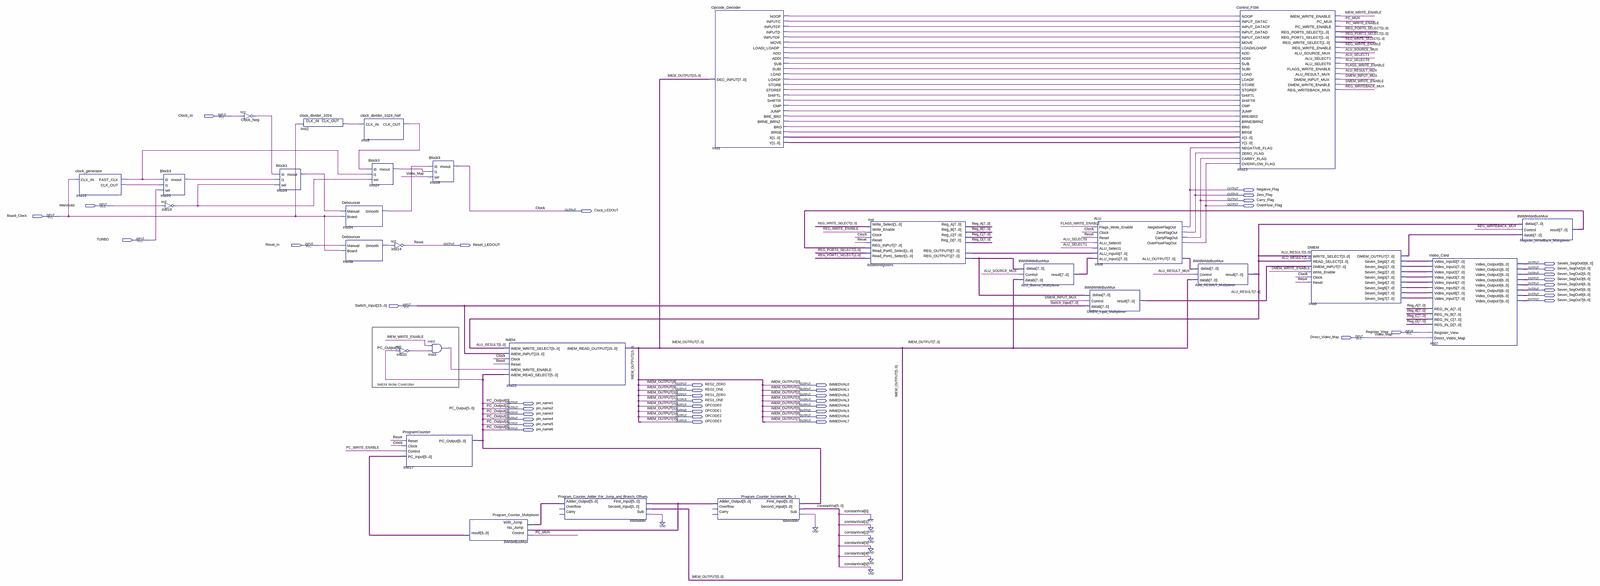
[diagram p0: schematic sheet, whole]
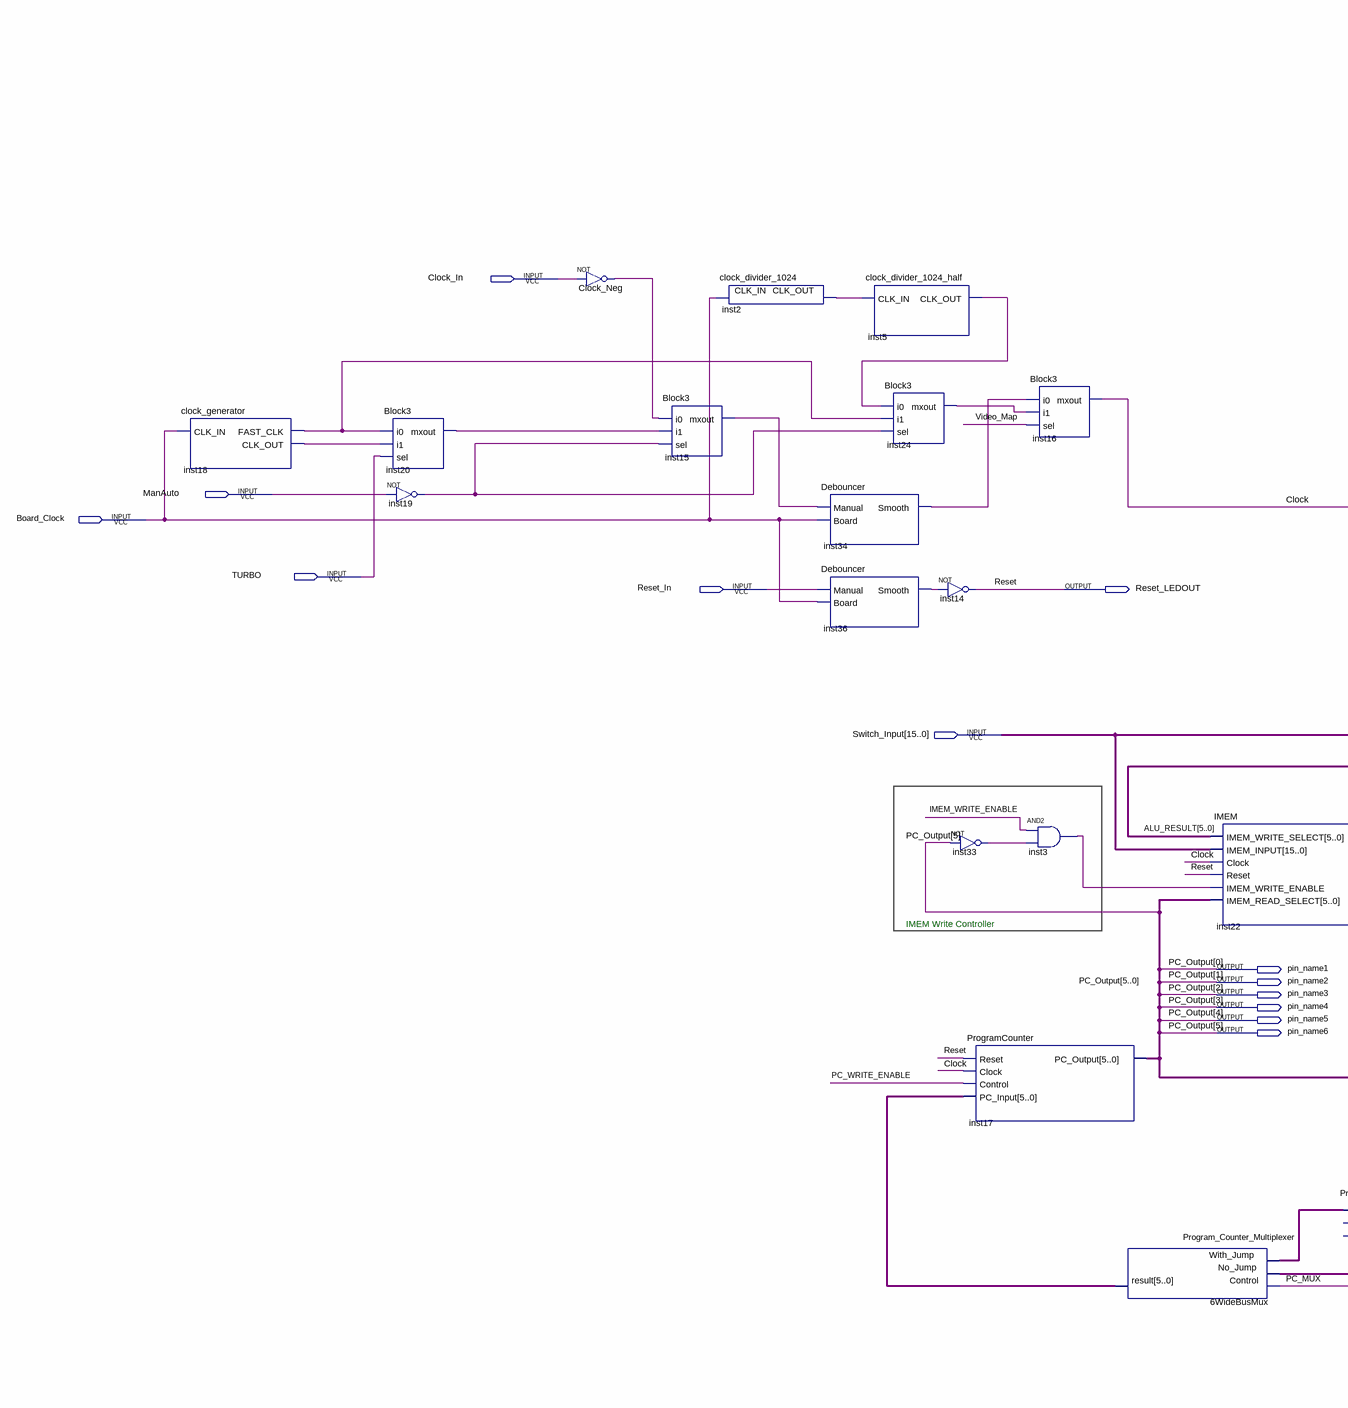
[diagram p1: schematic sheet, left part]
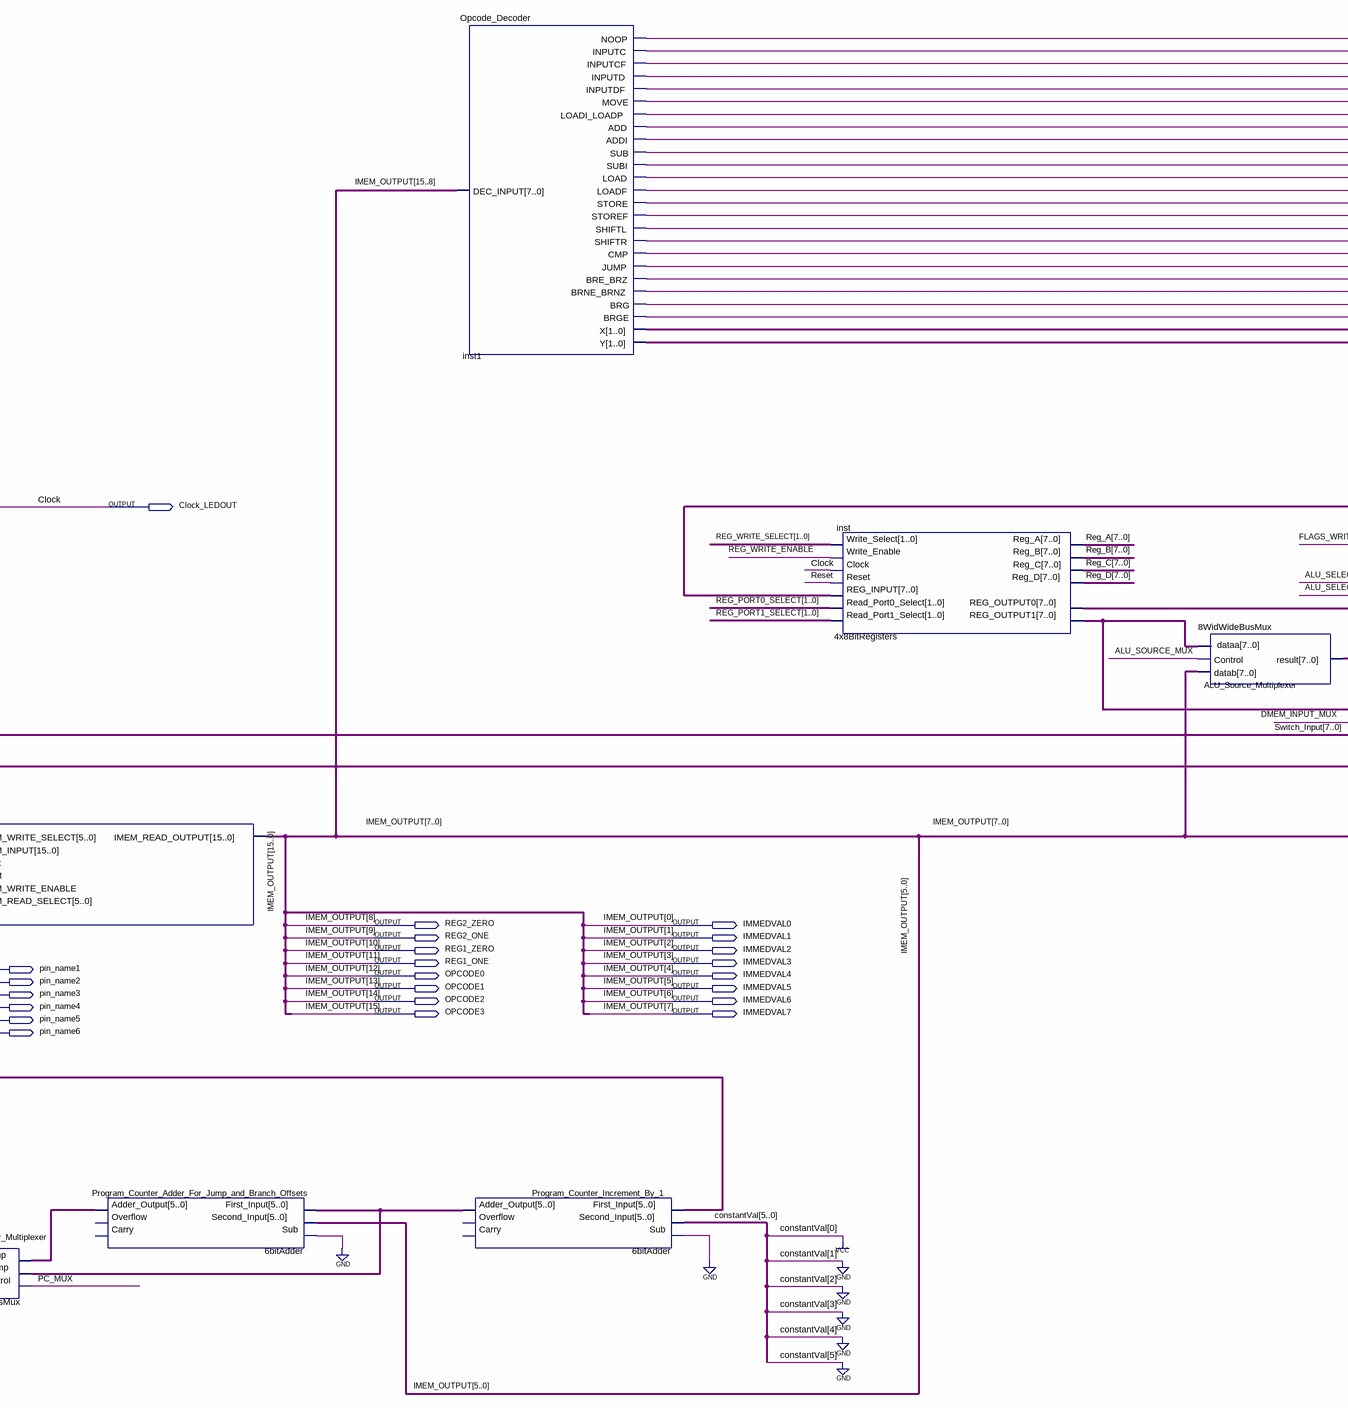
[diagram p2: schematic sheet, centre part]
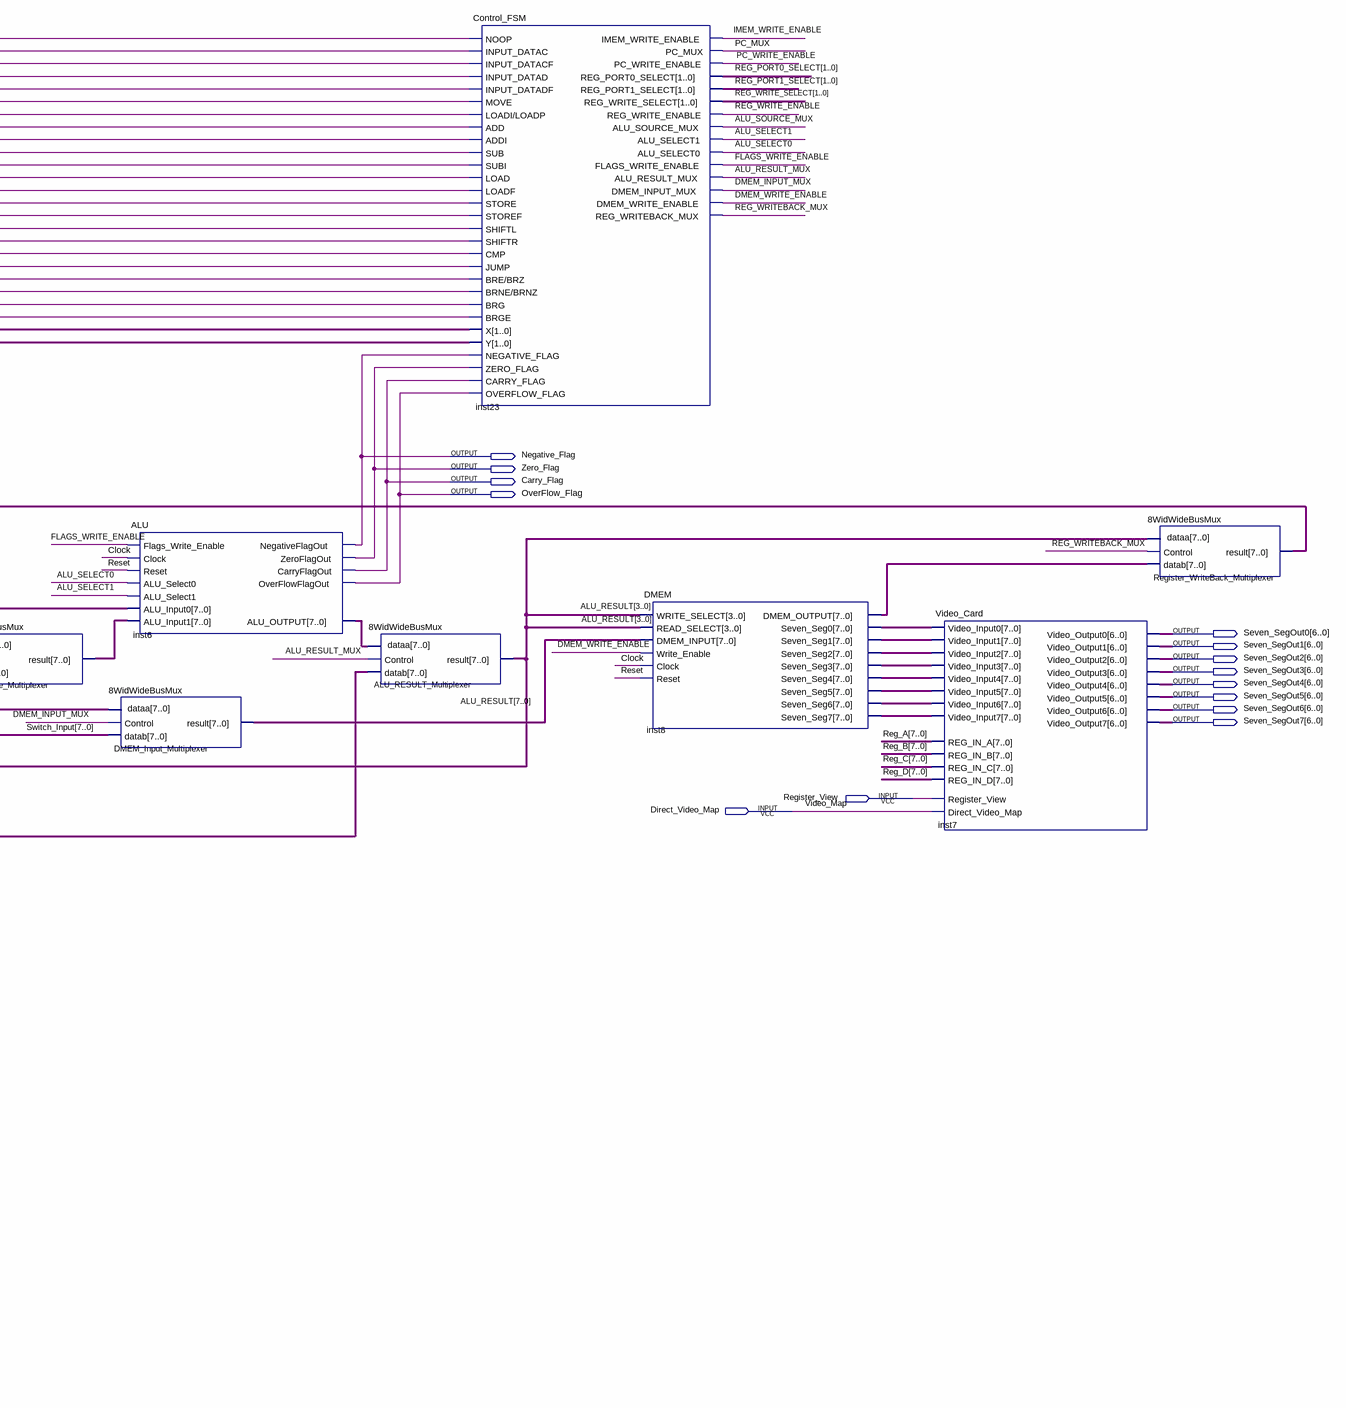
[diagram p3: schematic sheet, right part]
// Quartus schematic i281_CPU.bdf as structural Verilog: 29 symbols, 44 pins
module i281_CPU (
  input  Clock_In,
  input  ManAuto,
  input  Board_Clock,
  input  TURBO,
  input  Reset_In,
  input  [15:0] Switch_Input,
  input  Register_View,
  input  Direct_Video_Map,
  output Negative_Flag,
  output Zero_Flag,
  output Carry_Flag,
  output OverFlow_Flag,
  output Clock_LEDOUT,
  output Reset_LEDOUT,
  output [6:0] Seven_SegOut0,
  output [6:0] Seven_SegOut1,
  output [6:0] Seven_SegOut2,
  output [6:0] Seven_SegOut3,
  output [6:0] Seven_SegOut4,
  output [6:0] Seven_SegOut5,
  output [6:0] Seven_SegOut6,
  output [6:0] Seven_SegOut7,
  output REG2_ZERO,
  output IMMEDVAL0,
  output REG2_ONE,
  output IMMEDVAL1,
  output REG1_ZERO,
  output IMMEDVAL2,
  output REG1_ONE,
  output IMMEDVAL3,
  output pin_name1,
  output OPCODE0,
  output IMMEDVAL4,
  output pin_name2,
  output OPCODE1,
  output IMMEDVAL5,
  output pin_name3,
  output OPCODE2,
  output IMMEDVAL6,
  output pin_name4,
  output OPCODE3,
  output IMMEDVAL7,
  output pin_name5,
  output pin_name6
);

  wire ALU_RESULT_MUX, ALU_SELECT0, ALU_SELECT1, ALU_SOURCE_MUX, Clock_Neg_out, DMEM_INPUT_MUX,
       DMEM_WRITE_ENABLE, FLAGS_WRITE_ENABLE, IMEM_WRITE_ENABLE, inst1_add, inst1_addi, inst1_bre_brz,
       inst1_brg, inst1_brge, inst1_brne_brnz, inst1_cmp, inst1_inputc, inst1_inputcf, inst1_inputd,
       inst1_inputdf, inst1_jump, inst1_load, inst1_loadf, inst1_loadi_loadp, inst1_move, inst1_noop,
       inst1_shiftl, inst1_shiftr, inst1_store, inst1_storef, inst1_sub, inst1_subi, inst2_clk_out,
       inst3_out, inst5_clk_out, inst15_mxout, inst18_clk_out, inst18_fast_clk, inst19_out, inst20_mxout,
       inst24_mxout, inst33_out, inst34_smooth, inst36_smooth, PC_MUX, PC_WRITE_ENABLE, REG_WRITE_ENABLE,
       REG_WRITEBACK_MUX;
  wire [1:0] inst1_x, inst1_y, REG_PORT0_SELECT, REG_PORT1_SELECT, REG_WRITE_SELECT;
  wire [5:0] Program_Counter_Adder_For_Jump_and_Branch_Offsets_adder_output,
       Program_Counter_Increment_By_1_adder_output, Program_Counter_Multiplexer_result;
  wire [7:0] ALU_RESULT, ALU_Source_Multiplexer_result, DMEM_Input_Multiplexer_result, inst6_alu_output,
       inst8_dmem_output, inst8_seven_seg0, inst8_seven_seg1, inst8_seven_seg2, inst8_seven_seg3,
       inst8_seven_seg4, inst8_seven_seg5, inst8_seven_seg6, inst8_seven_seg7, inst_reg_output0,
       inst_reg_output1, Reg_A, Reg_B, Reg_C, Reg_D, Register_WriteBack_Multiplexer_result;

  clock_generator inst18 (.CLK_IN(Board_Clock), .FAST_CLK(inst18_fast_clk), .CLK_OUT(inst18_clk_out));
  Block3 inst20 (.i0(inst18_fast_clk), .i1(inst18_clk_out), .sel(TURBO), .mxout(inst20_mxout));
  not inst19 (inst19_out, ManAuto);
  not Clock_Neg (Clock_Neg_out, Clock_In);
  Block3 inst15 (.i0(Clock_Neg_out), .i1(inst20_mxout), .sel(inst19_out), .mxout(inst15_mxout));
  clock_divider_1024 inst2 (.CLK_IN(Board_Clock), .CLK_OUT(inst2_clk_out));
  Debouncer inst34 (.Manual(inst15_mxout), .Board(Board_Clock), .Smooth(inst34_smooth));
  Debouncer inst36 (.Manual(Reset_In), .Board(Board_Clock), .Smooth(inst36_smooth));
  clock_divider_1024_half inst5 (.CLK_IN(inst2_clk_out), .CLK_OUT(inst5_clk_out));
  Block3 inst24 (.i0(inst5_clk_out), .i1(inst18_fast_clk), .sel(inst19_out), .mxout(inst24_mxout));
  not inst14 (Reset_LEDOUT, inst36_smooth);
  not inst33 (inst33_out, pin_name6);
  ProgramCounter inst17 (
    .Reset(Reset_LEDOUT), .Clock(Clock_LEDOUT), .Control(PC_WRITE_ENABLE),
    .PC_Input(Program_Counter_Multiplexer_result),
    .PC_Output({pin_name6, pin_name5, pin_name4, pin_name3, pin_name2, pin_name1}));
  Block3 inst16 (.i0(inst34_smooth), .i1(inst24_mxout), .sel(Direct_Video_Map), .mxout(Clock_LEDOUT));
  and inst3 (inst3_out, IMEM_WRITE_ENABLE, inst33_out);
  \6WideBusMux  Program_Counter_Multiplexer (
    .Control(PC_MUX), .dataBline(Program_Counter_Adder_For_Jump_and_Branch_Offsets_adder_output),
    .dataAline(Program_Counter_Increment_By_1_adder_output), .result(Program_Counter_Multiplexer_result));
  IMEM inst22 (
    .Clock(Clock_LEDOUT), .Reset(Reset_LEDOUT),
    .IMEM_READ_SELECT({pin_name6, pin_name5, pin_name4, pin_name3, pin_name2, pin_name1}),
    .IMEM_WRITE_SELECT(ALU_RESULT[5:0]), .IMEM_INPUT(Switch_Input), .IMEM_WRITE_ENABLE(inst3_out),
    .IMEM_READ_OUTPUT({OPCODE3, OPCODE2, OPCODE1, OPCODE0, REG1_ONE, REG1_ZERO, REG2_ONE, REG2_ZERO, IMMEDVAL7, IMMEDVAL6, IMMEDVAL5, IMMEDVAL4, IMMEDVAL3, IMMEDVAL2, IMMEDVAL1, IMMEDVAL0}));
  \6bitAdder  Program_Counter_Adder_For_Jump_and_Branch_Offsets (
    .Sub(1'b0), .Second_Input({IMMEDVAL5, IMMEDVAL4, IMMEDVAL3, IMMEDVAL2, IMMEDVAL1, IMMEDVAL0}),
    .First_Input(Program_Counter_Increment_By_1_adder_output),
    .Adder_Output(Program_Counter_Adder_For_Jump_and_Branch_Offsets_adder_output));  // open: Carry, Overflow
  Opcode_Decoder inst1 (
    .DEC_INPUT({OPCODE3, OPCODE2, OPCODE1, OPCODE0, REG1_ONE, REG1_ZERO, REG2_ONE, REG2_ZERO}),
    .NOOP(inst1_noop), .INPUTC(inst1_inputc), .INPUTCF(inst1_inputcf), .INPUTD(inst1_inputd),
    .INPUTDF(inst1_inputdf), .MOVE(inst1_move), .LOADI_LOADP(inst1_loadi_loadp), .ADD(inst1_add),
    .ADDI(inst1_addi), .SUB(inst1_sub), .SUBI(inst1_subi), .LOAD(inst1_load), .LOADF(inst1_loadf),
    .STORE(inst1_store), .STOREF(inst1_storef), .SHIFTL(inst1_shiftl), .SHIFTR(inst1_shiftr),
    .CMP(inst1_cmp), .JUMP(inst1_jump), .BRE_BRZ(inst1_bre_brz), .BRNE_BRNZ(inst1_brne_brnz),
    .BRG(inst1_brg), .BRGE(inst1_brge), .X(inst1_x), .Y(inst1_y));
  \6bitAdder  Program_Counter_Increment_By_1 (
    .Sub(1'b0), .Second_Input(6'b000001),
    .First_Input({pin_name6, pin_name5, pin_name4, pin_name3, pin_name2, pin_name1}),
    .Adder_Output(Program_Counter_Increment_By_1_adder_output));  // open: Carry, Overflow
  \4x8BitRegisters  inst (
    .Read_Port1_Select(REG_PORT1_SELECT), .Read_Port0_Select(REG_PORT0_SELECT),
    .REG_INPUT(Register_WriteBack_Multiplexer_result), .Reset(Reset_LEDOUT), .Clock(Clock_LEDOUT),
    .Write_Enable(REG_WRITE_ENABLE), .Write_Select(REG_WRITE_SELECT), .Reg_A(Reg_A), .Reg_B(Reg_B),
    .REG_OUTPUT1(inst_reg_output1), .REG_OUTPUT0(inst_reg_output0), .Reg_C(Reg_C), .Reg_D(Reg_D));
  \8WidWideBusMux  ALU_Source_Multiplexer (
    .Control(ALU_SOURCE_MUX), .dataa(inst_reg_output1),
    .datab({IMMEDVAL7, IMMEDVAL6, IMMEDVAL5, IMMEDVAL4, IMMEDVAL3, IMMEDVAL2, IMMEDVAL1, IMMEDVAL0}),
    .result(ALU_Source_Multiplexer_result));
  \8WidWideBusMux  DMEM_Input_Multiplexer (
    .Control(DMEM_INPUT_MUX), .dataa(inst_reg_output1), .datab(Switch_Input[7:0]),
    .result(DMEM_Input_Multiplexer_result));
  ALU inst6 (
    .ALU_Select0(ALU_SELECT0), .ALU_Input0(inst_reg_output0), .ALU_Select1(ALU_SELECT1),
    .ALU_Input1(ALU_Source_Multiplexer_result), .Clock(Clock_LEDOUT), .Reset(Reset_LEDOUT),
    .Flags_Write_Enable(FLAGS_WRITE_ENABLE), .ALU_OUTPUT(inst6_alu_output), .NegativeFlagOut(Negative_Flag),
    .ZeroFlagOut(Zero_Flag), .CarryFlagOut(Carry_Flag), .OverFlowFlagOut(OverFlow_Flag));
  \8WidWideBusMux  ALU_RESULT_Multiplexer (
    .Control(ALU_RESULT_MUX), .dataa(inst6_alu_output),
    .datab({IMMEDVAL7, IMMEDVAL6, IMMEDVAL5, IMMEDVAL4, IMMEDVAL3, IMMEDVAL2, IMMEDVAL1, IMMEDVAL0}),
    .result(ALU_RESULT));
  Control_FSM inst23 (
    .OVERFLOW_FLAG(OverFlow_Flag), .INPUT_DATACF(inst1_inputcf), .INPUT_DATADF(inst1_inputdf),
    .NEGATIVE_FLAG(Negative_Flag), .NOOP(inst1_noop), .INPUT_DATAC(inst1_inputc), .INPUT_DATAD(inst1_inputd),
    .MOVE(inst1_move), .ADD(inst1_add), .ADDI(inst1_addi), .SUB(inst1_sub), .SUBI(inst1_subi),
    .LOAD(inst1_load), .LOADF(inst1_loadf), .STORE(inst1_store), .STOREF(inst1_storef),
    .SHIFTL(inst1_shiftl), .SHIFTR(inst1_shiftr), .CMP(inst1_cmp), .ZERO_FLAG(Zero_Flag), .JUMP(inst1_jump),
    .\BRE/BRZ (inst1_bre_brz), .\BRNE/BRNZ (inst1_brne_brnz), .BRG(inst1_brg), .CARRY_FLAG(Carry_Flag),
    .BRGE(inst1_brge), .\LOADI/LOADP (inst1_loadi_loadp), .X(inst1_x), .Y(inst1_y),
    .IMEM_WRITE_ENABLE(IMEM_WRITE_ENABLE), .PC_MUX(PC_MUX), .PC_WRITE_ENABLE(PC_WRITE_ENABLE),
    .REG_PORT0_SELECT(REG_PORT0_SELECT), .REG_PORT1_SELECT(REG_PORT1_SELECT),
    .REG_WRITE_SELECT(REG_WRITE_SELECT), .REG_WRITE_ENABLE(REG_WRITE_ENABLE),
    .ALU_SOURCE_MUX(ALU_SOURCE_MUX), .ALU_SELECT1(ALU_SELECT1), .ALU_SELECT0(ALU_SELECT0),
    .FLAGS_WRITE_ENABLE(FLAGS_WRITE_ENABLE), .ALU_RESULT_MUX(ALU_RESULT_MUX),
    .DMEM_INPUT_MUX(DMEM_INPUT_MUX), .DMEM_WRITE_ENABLE(DMEM_WRITE_ENABLE),
    .REG_WRITEBACK_MUX(REG_WRITEBACK_MUX));
  DMEM inst8 (
    .Write_Enable(DMEM_WRITE_ENABLE), .WRITE_SELECT(ALU_RESULT[3:0]), .Clock(Clock_LEDOUT),
    .DMEM_INPUT(DMEM_Input_Multiplexer_result), .Reset(Reset_LEDOUT), .READ_SELECT(ALU_RESULT[3:0]),
    .Seven_Seg7(inst8_seven_seg7), .Seven_Seg6(inst8_seven_seg6), .Seven_Seg5(inst8_seven_seg5),
    .Seven_Seg4(inst8_seven_seg4), .Seven_Seg3(inst8_seven_seg3), .Seven_Seg2(inst8_seven_seg2),
    .Seven_Seg1(inst8_seven_seg1), .Seven_Seg0(inst8_seven_seg0), .DMEM_OUTPUT(inst8_dmem_output));
  Video_Card inst7 (
    .Direct_Video_Map(Direct_Video_Map), .Register_View(Register_View), .Video_Input0(inst8_seven_seg0),
    .Video_Input1(inst8_seven_seg1), .Video_Input2(inst8_seven_seg2), .Video_Input3(inst8_seven_seg3),
    .Video_Input4(inst8_seven_seg4), .Video_Input5(inst8_seven_seg5), .Video_Input6(inst8_seven_seg6),
    .Video_Input7(inst8_seven_seg7), .REG_IN_D(Reg_D), .REG_IN_C(Reg_C), .REG_IN_B(Reg_B), .REG_IN_A(Reg_A),
    .Video_Output0(Seven_SegOut0), .Video_Output1(Seven_SegOut1), .Video_Output2(Seven_SegOut2),
    .Video_Output3(Seven_SegOut3), .Video_Output4(Seven_SegOut4), .Video_Output5(Seven_SegOut5),
    .Video_Output6(Seven_SegOut6), .Video_Output7(Seven_SegOut7));
  \8WidWideBusMux  Register_WriteBack_Multiplexer (
    .Control(REG_WRITEBACK_MUX), .dataa(ALU_RESULT), .datab(inst8_dmem_output),
    .result(Register_WriteBack_Multiplexer_result));

  // Other names for the same wires on the sheet: Clock = Clock_LEDOUT;
  //   IMEM_OUTPUT[15:0] = {OPCODE3, OPCODE2, OPCODE1, OPCODE0, REG1_ONE, REG1_ZERO, REG2_ONE, REG2_ZERO, IMMEDVAL7, IMMEDVAL6, IMMEDVAL5, IMMEDVAL4, IMMEDVAL3, IMMEDVAL2, IMMEDVAL1, IMMEDVAL0};
  //   PC_Output[5:0] = {pin_name6, pin_name5, pin_name4, pin_name3, pin_name2, pin_name1}; Reset = Reset_LEDOUT;
  //   Video_Map = Direct_Video_Map

  // Notes on the sheet:
  //   IMEM Write Controller
endmodule
